# Altium schematic sheet USBtoTTL.SchDoc: USB to TTL
size A4; SheetNumber: 4; SheetTotal: 4
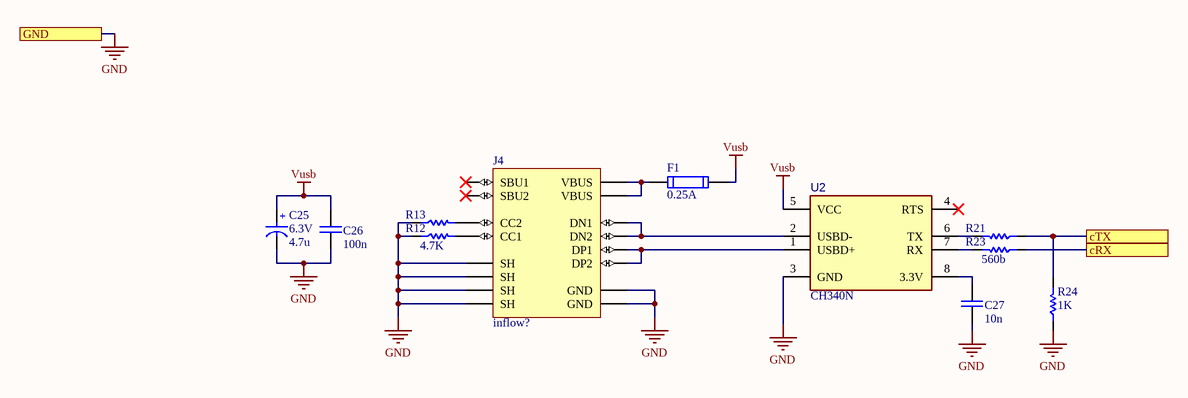
[diagram p0: USBtoTTL.SchDoc]

## Parts
C25  value 4.7u  Rating: 6.3V  [SMT_C_Tantalum_A]  (hidden comment: DS1307)
C26  value 100n  [CAP 0805/2012]  (hidden comment: DS1307)
C27  10n  [CAP 0805/2012]
F1  0.25A  [1206_F]
J4  Inflow: inflow?  [USBC_SMD_16_USB4110 - Extended]  (hidden comment: 16b)
R12  4.7K  [RES 0805 (2012X06L)]
R13  4.7K  [RES 0805 (2012X06L)]  (value not drawn)
R21  560b  [RES 0805 (2012X06L)]  (value not drawn)
R23  560b  [RES 0805 (2012X06L)]
R24  1K  [RES 0805 (2012X06L)]
U2  CH340N  [SO8_narrow_m]

## Ports
cRX, cTX, GND

## Nets
GND: C25.2(-) C26.2 C27.2 J4.A1B12(GND) J4.B1A12(GND) J4.S1(SH) J4.S2(SH) J4.S3(SH) J4.S4(SH) R12.1 R13.1 R24.1 U2.3(GND) ; port GND
Vusb: C25.1(+) C26.1 F1.2 U2.5(VCC)
cRX: R23.1 ; port cRX
cTX: R21.1 R24.2 ; port cTX
NetC27_1: C27.1 U2.8(3.3V)
NetF1_1: F1.1 J4.A4B9(VBUS) J4.B4A9(VBUS)
NetJ4_A5: J4.A5(CC1) R12.2
NetJ4_A6: J4.A6(DP1) J4.B6(DP2) U2.1(USBD+)
NetJ4_A7: J4.A7(DN1) J4.B7(DN2) U2.2(USBD-)
NetJ4_B5: J4.B5(CC2) R13.2
NetR21_2: R21.2 U2.6(TX)
NetR23_2: R23.2 U2.7(RX)

Not connected (* = marked no-connect by the designer): J4 A8(SBU1)* B8(SBU2)*; U2 4(RTS)*

## Notes on the sheet
- Title:
- Project:
- Drawn by:
- Revision:
- Hossein Bagheri
- Company:
- Sheet
- of

## Library data of the parts
C25 = Cap_Tantalum: Tantalum Capacitor,TAJ Series-SMD; Inflow: inflow?; Package: SMD-A; Type: Tantalum
C26 C27 = Cap_Multi_SMD_100nF_0805: Bipolar ceramic capacitor SMD; Inflow: inflow?; Type: MultiLayer; Rating: 50V; Package: 0805
  C27: Value: 10n
F1 = Other_Elec_Fuse_SMD: Short circiut  protection; Inflow: 0.5A; Type: Fast; Rating: Rating?; Package: 1206; Value: 0.25A
J4 = Con_USB_C_16P: USB C Female Connector; Rating: Rating?; Validation: NT; Value: 16b; Package: SMD; Type: C
R12 R13 R21 R23 R24 = Res_SMD_0805: Resistor; Inflow: inflow?; Rating: 0.125W; Package: 0805; Type: 10%
  R12 R13: Value: 4.7K
  R21 R23: Value: 560b
  R24: Value: 1K
U2 = IC_Converter_CH340N: TTL To USB Chip; Rating: Rating?; Inflow: inflow?; Type: USB to TTL; Package: SO-8; Value: CH340N